# EasyEDA Pro project MiaoUI_TestBoard.epro

# Schematic Schematic1
Board Name: Board1; Create Date: 2024-10-20
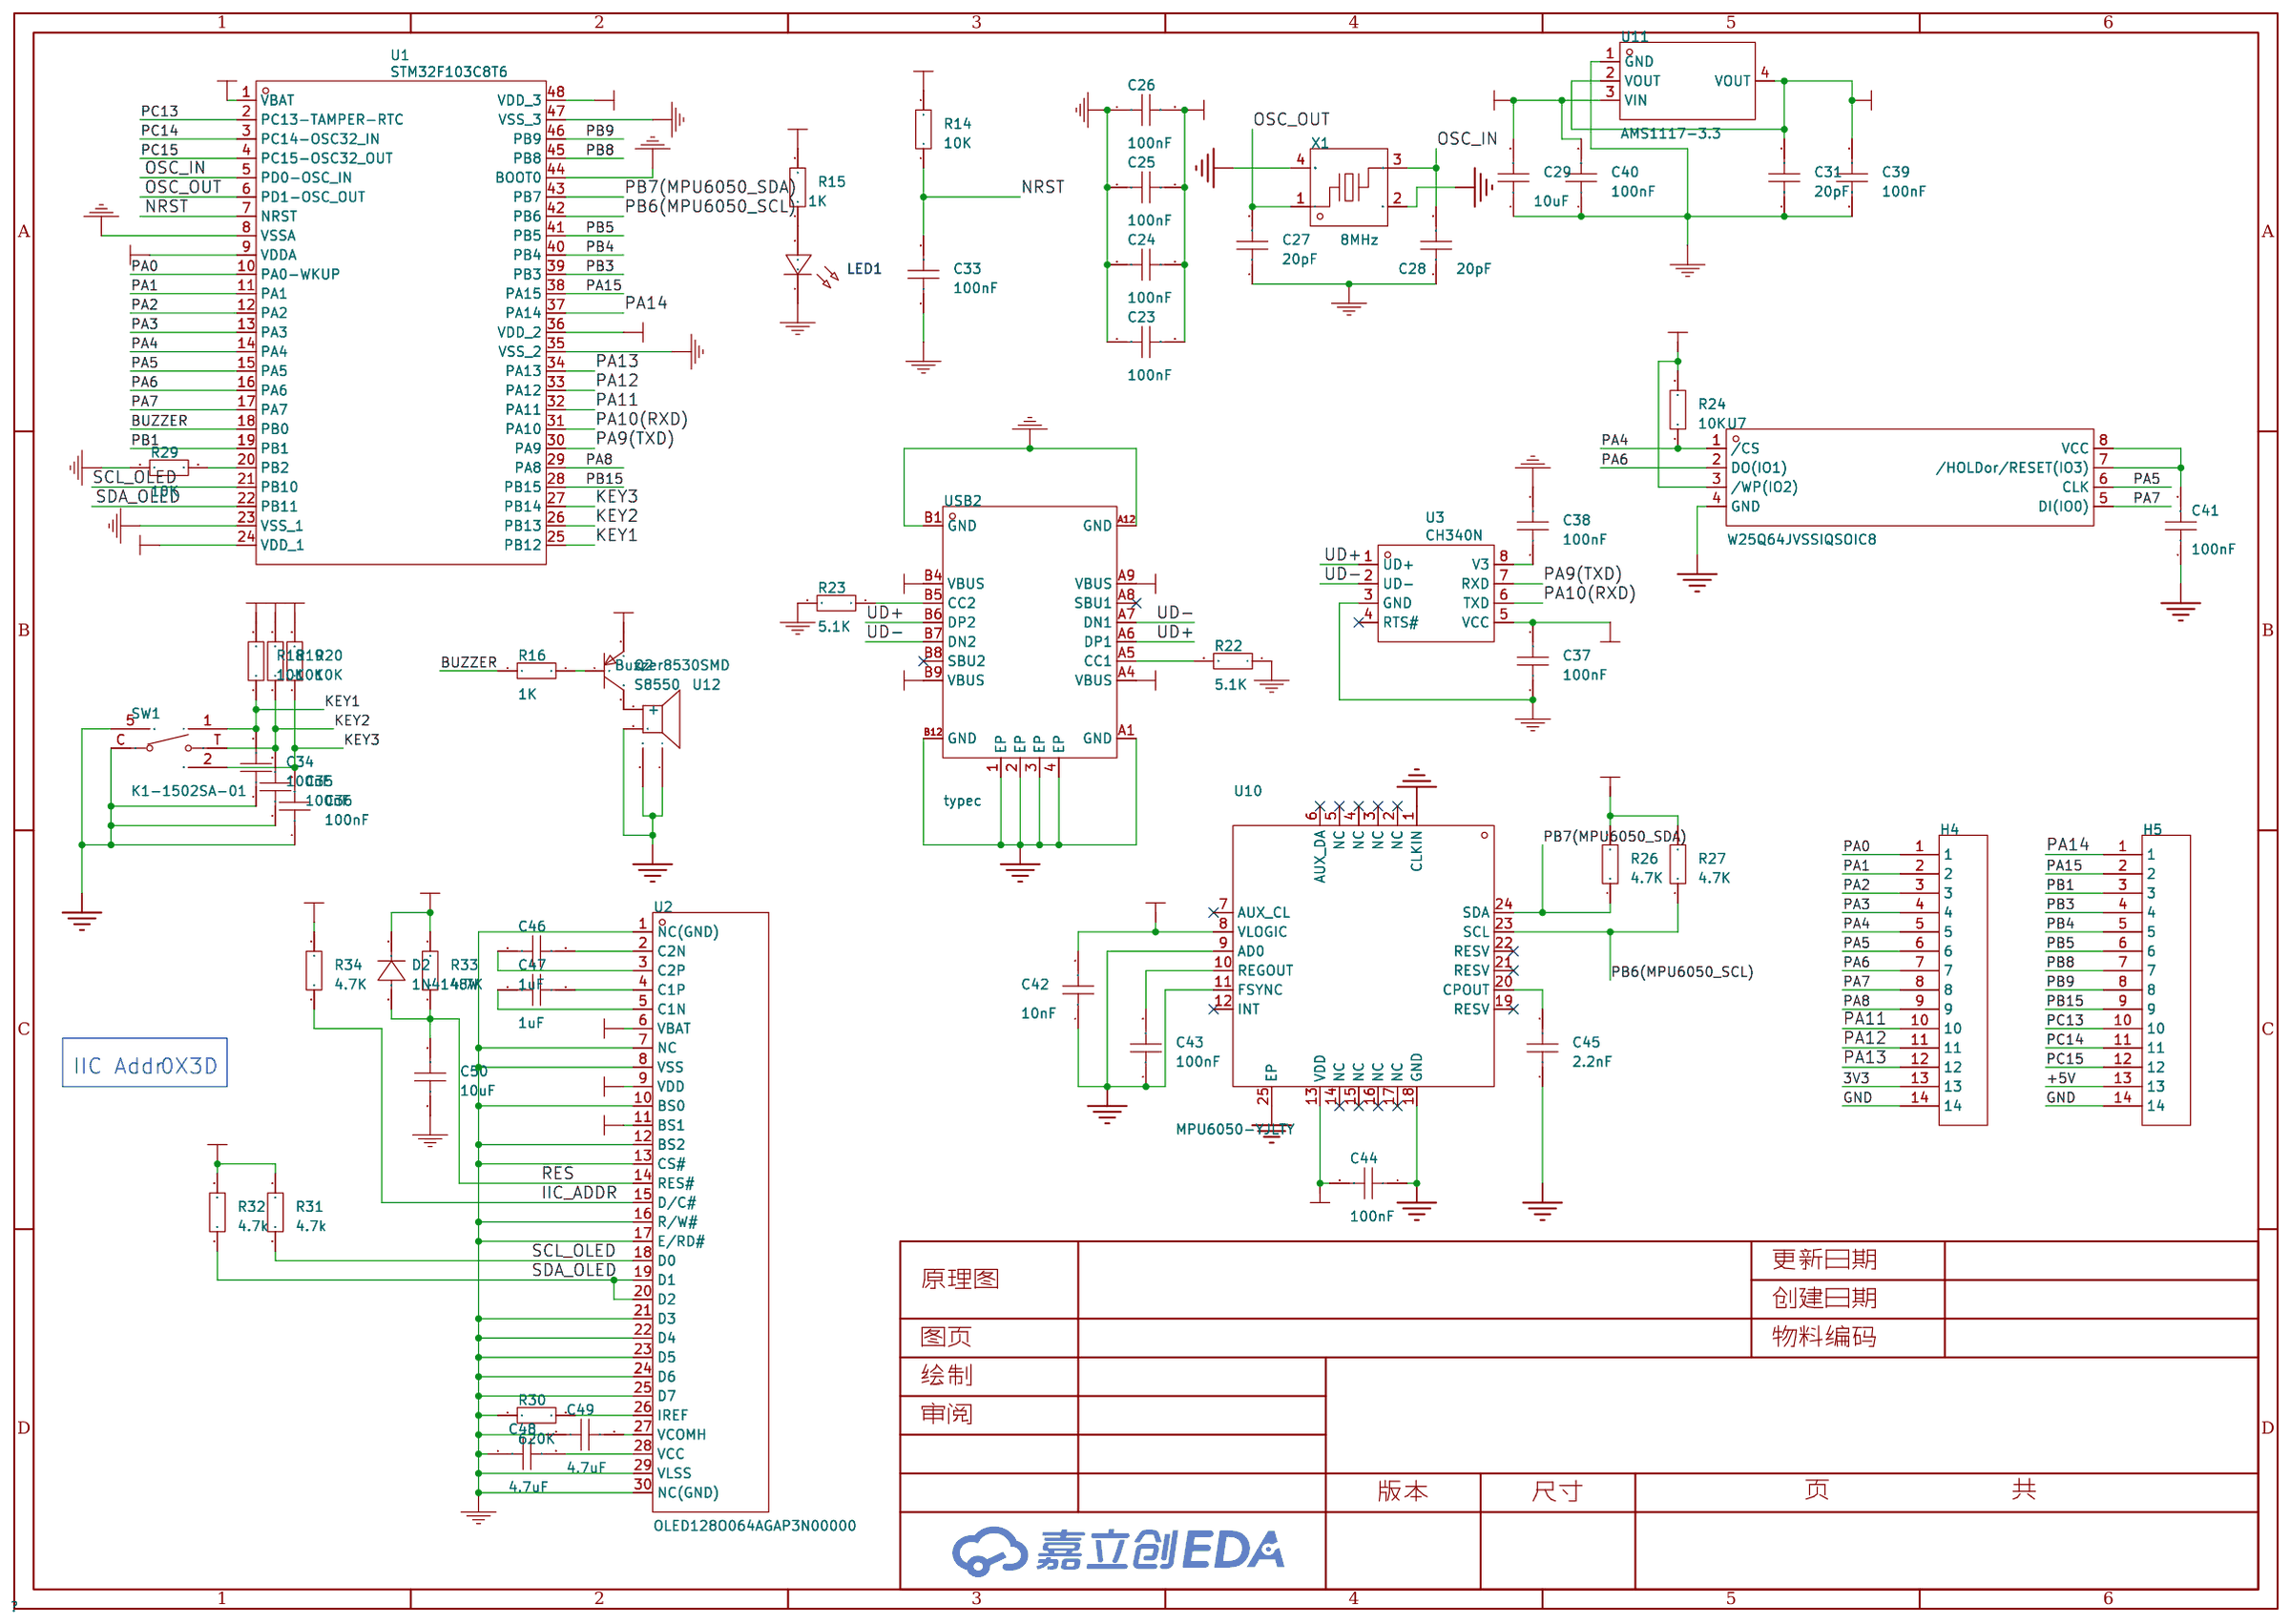
[diagram p0: schematic sheet]

## Parts
C23  100nF  [C0603]
C24  100nF  [C0603]
C25  100nF  [C0603]
C26  100nF  [C0603]
C27  20pF  [C0603]
C28  20pF  [C0603]
C29  10uF  [C0603]
C31  20pF  [C0603]
C33  100nF  [C0603]
C34  100nF  [C0603]
C35  100nF  [C0603]
C36  100nF  [C0603]
C37  100nF  [C0603]
C38  100nF  [C0603]
C39  100nF  [C0603]
C40  100nF  [C0603]
C41  100nF  [C0603]
C42  10nF  [C0603]
C43  100nF  [C0603]
C44  100nF  [C0603]
C45  2.2nF  [C0603]
C46  1uF  [C0603]
C47  1uF  [C0603]
C48  4.7uF  [C0603]
C49  4.7uF  [C0603]
C50  10uF  [C0603]
D2  1N4148W  [SOD-123_L2.7-W1.6-LS3.7-RD-1]
H4  -  [HDR-TH_14P-P2.54-V-F-1]
H5  -  [HDR-TH_14P-P2.54-V-F-1]
LED1  -  [LED_0603]
Q2  S8550  [SOT-23-3_L2.9-W1.3-P1.90-LS2.4-BR]
R14  10K  [R0603]
R15  1K  [R0603]
R16  1K  [R0603]
R18  10K  [R0603]
R19  10K  [R0603]
R20  10K  [R0603]
R22  5.1K  [R0603]
R23  5.1K  [R0603]
R24  10K  [R0603]
R26  4.7K  [R0603]
R27  4.7K  [R0603]
R29  10K  [R0603]
R30  620K  [R0603]
R31  4.7k  [R0603]
R32  4.7k  [R0603]
R33  4.7K  [R0603]
R34  4.7K  [R0603]
SW1  K1-1502SA-01  [KEY-SMD_K1-1502SA-01]
U1  STM32F103C8T6  [LQFP-48_L7.0-W7.0-P0.50-LS9.0-BL]
U2  OLED128O064AGAP3N00000  [tft-smd_oled128o064agap3n00000]
U3  CH340N  [SOP-8_L5.0-W4.0-P1.27-LS6.0-BL]
U7  W25Q64JVSSIQSOIC8  [SOIC-8_L5.3-W5.3-P1.27-LS7.9-BL]
U10  MPU6050-YJLTY  [QFN-24_L4.0-W4.0-P0.50-BL-EP2.7]
U11  AMS1117-3.3  [SOT-223-3_L6.5-W3.4-P2.30-LS7.0-BR]
U12  Buzzer8530SMD  [BUZ-SMD_4P-L8.5-W8.5-P8.50-TL]
USB2  typec  [usb-c-smd_kh-type-c-16p]
X1  8MHz  [OSC-SMD_4P-L3.2-W2.5-BL]

## Library data of the parts
C23-C29 C31 C33-C50 = CAP_0603: Supplier Footprint: 0603
D2 = 1N4148W: 二极管配置:-;正向压降(Vf):1.25V@100mA;直流反向耐压(Vr):-;平均整流电流(Io):150mA;功率:500mW;反向恢复时间(trr):4ns;; LCSC Part Name: 电流:150mA; Supplier Part: C2892570; Manufacturer: YONGYUTAI(永裕泰); Supplier Footprint: SOD-123; JLCPCB Part Class: 扩展库; Datasheet: https://atta.szlcsc.com/upload/public/pdf/source/20210906/424708ED2E76C29D36F058AA2585E916.pdf; Supplier: LCSC; Forward Voltage (Vf@If): 1.25V@100mA; Average Rectified Current (Io): 150mA; Power Dissipation: 500mW; Reverse Leakage Current: 5uA@75V; Reverse Recovery Time (trr): 4ns
H4 H5 = HDR-F-2.54_1x14P: Supplier Part: C52711; Supplier Footprint: 插件
LED1 = LED_0603-B: Supplier Footprint: 0603
Q2 = S8550: LCSC Part Name: PNP -25V -500mA 120-400 SOT-23; Supplier Part: C2931720; Manufacturer: Doeshare(德芯); Supplier Footprint: SOT-23; JLCPCB Part Class: 扩展库; Datasheet: https://atta.szlcsc.com/upload/public/pdf/source/20220104/15A23F6542E365B9E2BA018BE45092B6.pdf; Supplier: LCSC
R14-R16 R18-R20 R22-R24 R26 R27 R29-R34 = Res_0603: Supplier Footprint: 0603
SW1 = K1-1502SA-01: Supplier Part: C145915; Manufacturer: 韩国韩荣; Supplier Footprint: SMD,12.4x11.8mm; Datasheet: https://atta.szlcsc.com/upload/public/pdf/source/20210810/68556D289DEA90EEE2C9C67C3CF0D02D.pdf; Supplier: LCSC
U1 = STM32F103C8T6: Supplier: LCSC; Manufacturer: ST(意法半导体); Supplier Part: C8734; JLCPCB Part Class: Extended Part; link: https://so.szlcsc.com/global.html?k=C8734&amp;ref=editor
U2 = OLED128O064AGAP3N00000: 接口类型:-;尺寸(inch):-;像素分辨率:-;; Supplier Part: C17246337; Manufacturer: VISHAY(威世); Supplier: LCSC
U3 = CH340N: Supplier: LCSC; Supplier Part: C506813; Manufacturer: WCH(南京沁恒); JLCPCB Part Class: Extended Part; link: https://so.szlcsc.com/global.html?k=C506813&amp;ref=editor
U7 = W25Q64JVSSIQSOIC8: Supplier Part: C9900009206; Supplier Footprint: SOIC-8-208mil; JLCPCB Part Class: 扩展库; Supplier: LCSC
U10 = MPU6050-YJLTY: Supplier Part: C2912107; Supplier Footprint: QFN-24-EP(4x4); JLCPCB Part Class: 扩展库; Supplier: LCSC
U11 = AMS1117-3.3_C6186: 输出类型:固定;最大输入电压:-;输出电压:3.3V;最大输出电流:1A;电源纹波抑制比(PSRR):72dB@(120Hz);输出极性:正极;; LCSC Part Name: 输出3.3V 1A; Supplier Part: C6186; Manufacturer: AMS; Supplier Footprint: SOT-223; JLCPCB Part Class: 基础库; Datasheet: https://atta.szlcsc.com/upload/public/pdf/source/20180727/C6186_7A095716F0823C02F1997A905E26C086.pdf; Supplier: LCSC; Output Type: 固定; Output Voltage: 3.3V; MAX Output Current: 1A; Power Supply Rejection Ratio (PSRR): 72dB@(120Hz); Dropout Voltage: 1.3V@(800mA); Output Polarity: 正极; Number of Outputs: 1
U12 = Buzzer8530SMD: Supplier Part: C9900004191; Supplier Footprint: BuzzerMLT8530; JLCPCB Part Class: 扩展库; Supplier: LCSC
USB2 = typec: Supplier Part: C9900016956; Supplier Footprint: typec 12p; JLCPCB Part Class: 扩展库; Supplier: LCSC
X1 = X32258MOB4SI: 晶振类型:贴片晶振;频率:8MHz;常温频差:±10ppm;外接负载电容:12pF;频率稳定度(全温):±20ppm;; LCSC Part Name: 8MHz ±10ppm 12pF; Supplier Part: C2682775; Manufacturer: YXC(扬兴晶振); Supplier Footprint: SMD3225-4P; JLCPCB Part Class: 扩展库; Datasheet: https://atta.szlcsc.com/upload/public/pdf/source/20240329/19D5F850207469550BEB00D7DFEDBC7A.pdf; Supplier: LCSC; Crystal Type: 贴片晶振; Normal temperature Frequency Tolerance: ±10ppm; External load capacitor: 12pF; Frequency Stability(Full temperature range): ±20ppm; Equivalent Series Resistance (ESR): 150Ω; Operating Temperature: -40℃~+85℃

## Nets
3V3: C23.2 C24.2 C25.2 C26.2 C31.2 C39.2 C42.2 C44.2 D2.1(K) H4.13 Q2.2(E) R14.2 R15.2 R18.2 R19.2 R20.2 R24.2 R26.2 R27.2 R31.1 R32.2 R33.2 R34.2 U1.1(VBAT) U1.9(VDDA) U1.24(VDD_1) U1.36(VDD_2) U1.48(VDD_3) U2.6(VBAT) U2.9(VDD) U2.11(BS1) U7.3(/WP(IO2)) U10.8(VLOGIC) U10.13(VDD) U11.2(VOUT) U11.4(VOUT)
+5V: C29.2 C37.2 C40.2 H5.13 U3.5(VCC) U11.3(VIN) USB2.A4(VBUS) USB2.A9(VBUS) USB2.B4(VBUS) USB2.B9(VBUS)
GND: C23.1 C24.1 C25.1 C26.1 C27.1 C28.1 C29.1 C31.1 C33.1 C34.1 C35.1 C36.1 C37.1 C38.2 C39.1 C40.1 C41.1 C42.1 C43.1 C44.1 C45.1 C48.1 C49.1 C50.1 H4.14 H5.14 LED1.1(C) R22.1 R23.2 R29.1 R30.1 SW1.5 SW1.C U1.8(VSSA) U1.23(VSS_1) U1.35(VSS_2) U1.44(BOOT0) U1.47(VSS_3) U2.1(NC(GND)) U2.7(NC) U2.8(VSS) U2.10(BS0) U2.12(BS2) U2.13(CS#) U2.16(R/W#) U2.17(E/RD#) U2.21(D3) U2.22(D4) U2.23(D5) U2.24(D6) U2.25(D7) U2.29(VLSS) U2.30(NC(GND)) U3.3(GND) U7.4(GND) U10.1(CLKIN) U10.9(AD0) U10.11(FSYNC) U10.18(GND) U10.25(EP) U11.1(GND) U12.2 U12.3 U12.4 USB2.1(EP) USB2.2(EP) USB2.3(EP) USB2.4(EP) USB2.A1(GND) USB2.A12(GND) USB2.B1(GND) USB2.B12(GND) X1.2(GND) X1.4(GND)
BUZZER: R16.1 U1.18(PB0)
IIC_ADDR: R34.1 U2.15(D/C#)
KEY1: C34.2 R18.1 SW1.1 U1.25(PB12)
KEY2: C35.2 R19.1 SW1.T U1.26(PB13)
KEY3: C36.2 R20.1 SW1.2 U1.27(PB14)
NRST: C33.2 R14.1 U1.7(NRST)
OSC_IN: C28.2 U1.5(PD0-OSC_IN) X1.3
OSC_OUT: C27.2 U1.6(PD1-OSC_OUT) X1.1
PA0: H4.1 U1.10(PA0-WKUP)
PA1: H4.2 U1.11(PA1)
PA2: H4.3 U1.12(PA2)
PA3: H4.4 U1.13(PA3)
PA4: H4.5 R24.1 U1.14(PA4) U7.1(/CS)
PA5: H4.6 U1.15(PA5) U7.6(CLK)
PA6: H4.7 U1.16(PA6) U7.2(DO(IO1))
PA7: H4.8 U1.17(PA7) U7.5(DI(IO0))
PA8: H4.9 U1.29(PA8)
PA9(TXD): U1.30(PA9) U3.7(RXD)
PA10(RXD): U1.31(PA10) U3.6(TXD)
PA11: H4.10 U1.32(PA11)
PA12: H4.11 U1.33(PA12)
PA13: H4.12 U1.34(PA13)
PA14: H5.1 U1.37(PA14)
PA15: H5.2 U1.38(PA15)
PB1: H5.3 U1.19(PB1)
PB3: H5.4 U1.39(PB3)
PB4: H5.5 U1.40(PB4)
PB5: H5.6 U1.41(PB5)
PB6(MPU6050_SCL): R27.1 U1.42(PB6) U10.23(SCL)
PB7(MPU6050_SDA): R26.1 U1.43(PB7) U10.24(SDA)
PB8: H5.7 U1.45(PB8)
PB9: H5.8 U1.46(PB9)
PB15: H5.9 U1.28(PB15)
PC13: H5.10 U1.2(PC13-TAMPER-RTC)
PC14: H5.11 U1.3(PC14-OSC32_IN)
PC15: H5.12 U1.4(PC15-OSC32_OUT)
RES: C50.2 D2.2(A) R33.1 U2.14(RES#)
SCL_OLED: R31.2 U1.21(PB10) U2.18(D0)
SDA_OLED: R32.1 U1.22(PB11) U2.19(D1) U2.20(D2)
UD+: U3.1(UD+) USB2.A6(DP1) USB2.B6(DP2)
UD-: U3.2(UD-) USB2.A7(DN1) USB2.B7(DN2)
$1N2097: LED1.2(A) R15.1
$1N2713: R30.2 U2.26(IREF)
$1N2714: C49.2 U2.27(VCOMH)
$1N2715: C48.2 U2.28(VCC)
$1N2716: C46.1 U2.3(C2P)
$1N2717: C46.2 U2.2(C2N)
$1N2718: C47.1 U2.5(C1N)
$1N2719: C47.2 U2.4(C1P)
$1N4956: Q2.1(B) R16.2
$1N5026: Q2.3(C) U12.1(+)
$1N6067: C38.1 U3.8(V3)
$1N6367: C41.2 U7.7(/HOLDor/RESET(IO3)) U7.8(VCC)
$1N6697: C43.2 U10.10(REGOUT)
$1N6965: C45.2 U10.20(CPOUT)
$1N8605: R29.2 U1.20(PB2)
$1N9414: R22.2 USB2.A5(CC1)
$1N9519: R23.1 USB2.B5(CC2)

Not connected (* = marked no-connect by the designer): U3 4(RTS#)*; U10 2(NC)* 3(NC)* 4(NC)* 5(NC)* 6(AUX_DA)* 7(AUX_CL)* 12(INT)* 14(NC)* 15(NC)* 16(NC)* 17(NC)* 19(RESV)* 21(RESV)* 22(RESV)*; USB2 A8(SBU1)* B8(SBU2)*

## Notes on the sheet
- IIC Addr
- 0X3D

# Board PCB1
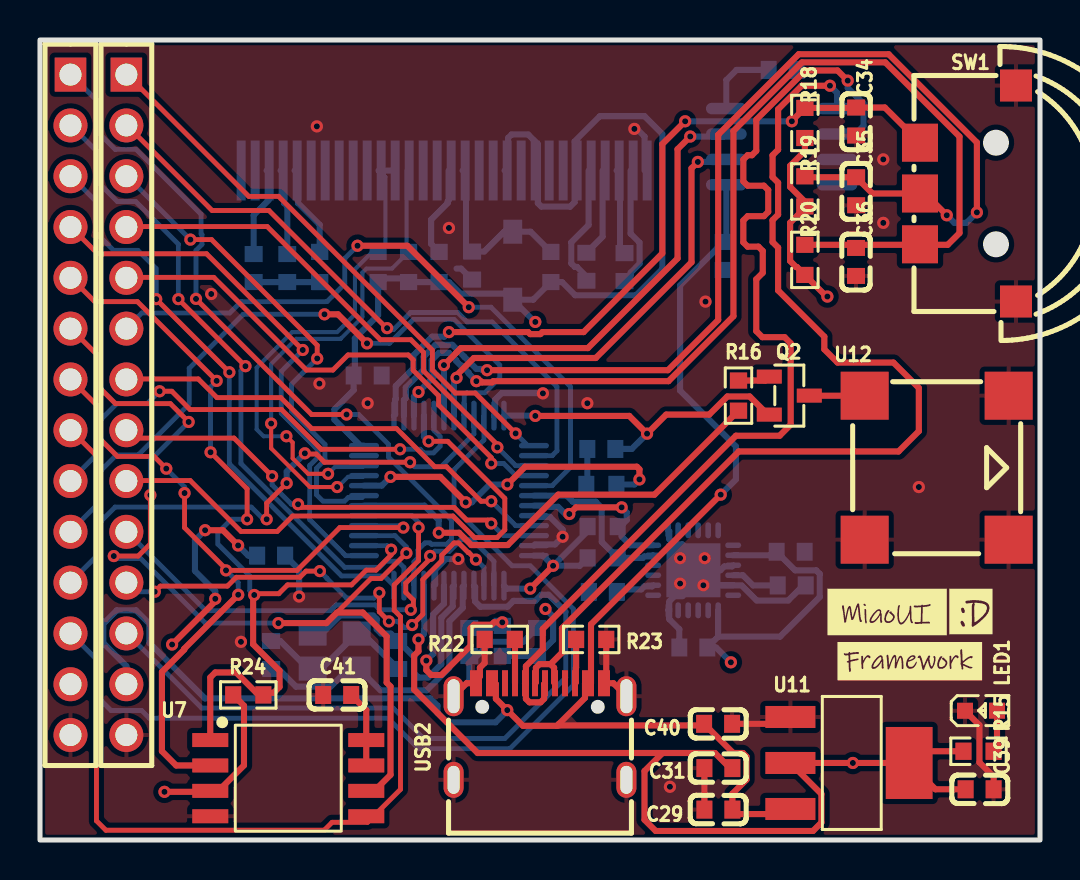
[diagram p1: board, top side]
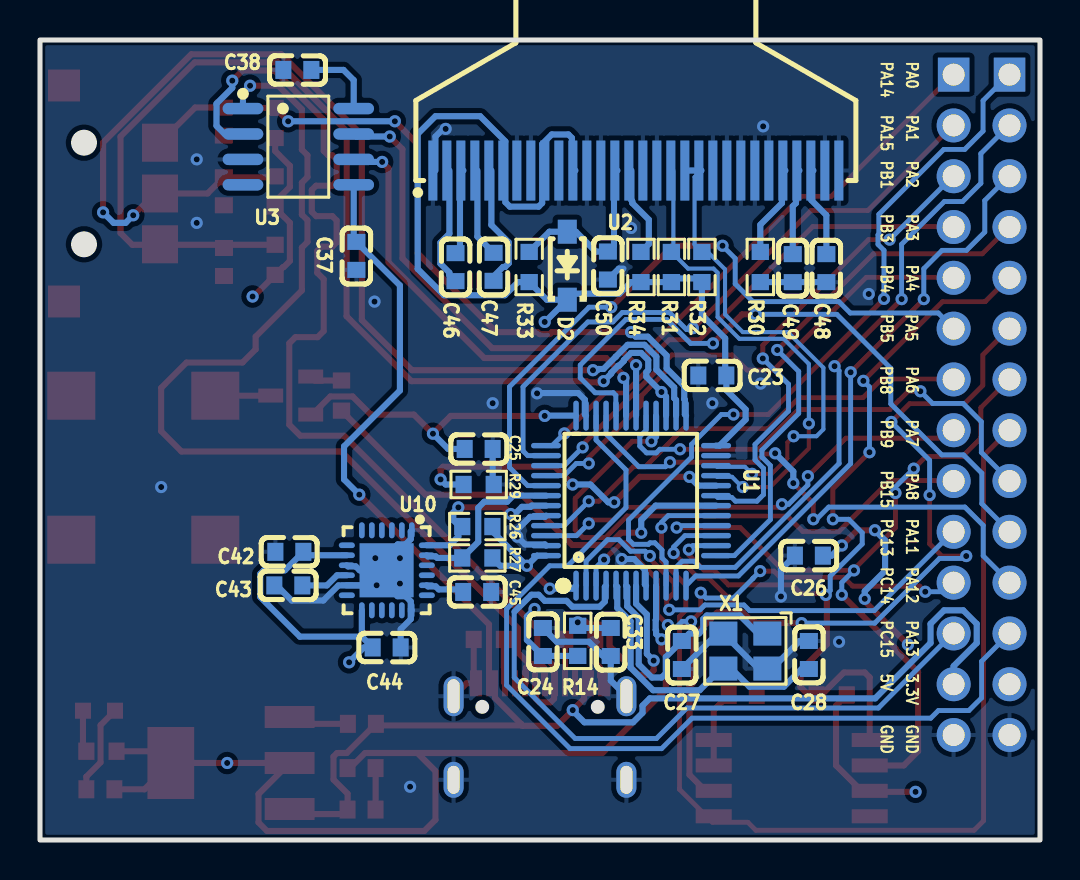
[diagram p2: board, bottom side, seen from below]

Outline 50 x 40 mm; copper layers: Top Layer, Inner1, Inner2, Bottom Layer. Coordinates in mm from the lower left corner of the outline.
Outline path: rectangle 0,40 50,0
Stack: Top Layer 0.035mm 外层铜厚1oz / Dielectric1 0.2104mm 7628 RC49% 8.6mil / Inner1 0.0152mm 内层铜厚 / Dielectric2 1.065mm 1.1mm H/HOZ Copper / Inner2 0.0152mm 内层铜厚 / Dielectric3 0.2104mm 7628 RC49% 8.6mil / Bottom Layer 0.035mm 外层铜厚1oz

## Design rules (mm)
template: 自定义配置
spacing copperThickness1oz (default): track to track 0.102, other pairs 0.152 to 0.3
spacing copperThickness2oz: track to track 0.203, other pairs 0.152 to 0.3
track width copperThickness1oz (default): min 0.127, default 0.305, max 2.54
track width copperThickness2oz: min 0.203, default 0.254, max 2.54
differential pair differentialPair (default): width min 0.127, default 0.254, max 2.54; gap min 0.152, default 0.152
via viaSize (default): diameter min 0.5, default 0.61, max 10; hole min 0.3, default 0.305, max 6.299

## Placement (name value [footprint] x y rotation side)
C23  100nF  [C0603]  16.38 23.23 180 bottom
C24  100nF  [C0603]  24.86 9.9 270 bottom
C25  100nF  [C0603]  28.07 19.55 0 bottom
C26  100nF  [C0603]  11.56 14.22 180 bottom
C27  20pF  [C0603]  17.91 9.25 90 bottom
C28  20pF  [C0603]  11.56 9.25 270 bottom
C29  10uF  [C0603]  33.92 1.52 0 top
C31  20pF  [C0603]  33.92 3.59 0 top
C33  100nF  [C0603]  21.46 9.9 90 bottom
C34  100nF  [C0603]  40.81 35.92 90 top
C35  100nF  [C0603]  40.81 32.44 90 top
C36  100nF  [C0603]  40.8 28.9 90 top
C37  100nF  [C0603]  34.18 29.2 90 bottom
C38  100nF  [C0603]  37.13 38.5 0 bottom
C39  100nF  [C0603]  46.98 2.53 180 top
C40  100nF  [C0603]  33.9 5.81 180 top
C41  100nF  [C0603]  14.86 7.25 0 top
C42  10nF  [C0603]  37.53 14.41 180 bottom
C43  100nF  [C0603]  37.58 12.73 180 bottom
C44  100nF  [C0603]  32.67 9.63 0 bottom
C45  2.2nF  [C0603]  28.14 12.4 0 bottom
C46  1uF  [C0603]  29.22 28.64 270 bottom
C47  1uF  [C0603]  27.32 28.66 90 bottom
C48  4.7uF  [C0603]  10.68 28.59 90 bottom
C49  4.7uF  [C0603]  12.36 28.59 90 bottom
C50  10uF  [C0603]  21.6 28.72 90 bottom
D2  1N4148W  [SOD-123_L2.7-W1.6-LS3.7-RD-1]  23.64 28.71 90 bottom
H4  -  [HDR-TH_14P-P2.54-V-F-1]  1.52 21.76 270 top
H5  -  [HDR-TH_14P-P2.54-V-F-1]  4.32 21.76 270 top
LED1  -  [LED_0603]  47.1 6.47 0 top
Q2  S8550  [SOT-23-3_L2.9-W1.3-P1.90-LS2.4-BR]  37.47 22.22 180 top
R14  10K  [R0603]  23.11 9.96 270 bottom
R15  1K  [R0603]  46.93 4.44 180 top
R16  1K  [R0603]  34.93 22.22 90 top
R18  10K  [R0603]  38.24 35.85 270 top
R19  10K  [R0603]  38.24 32.43 270 top
R20  10K  [R0603]  38.24 29.01 270 top
R22  5.1K  [R0603]  22.99 10.03 0 top
R23  5.1K  [R0603]  27.56 10.03 0 top
R24  10K  [R0603]  10.41 7.25 180 top
R26  4.7K  [R0603]  28.13 15.67 180 bottom
R27  4.7K  [R0603]  28.13 14.1 180 bottom
R29  10K  [R0603]  28.07 17.78 0 bottom
R30  620K  [R0603]  13.98 28.65 90 bottom
R31  4.7k  [R0603]  18.43 28.65 90 bottom
R32  4.7k  [R0603]  16.91 28.65 270 bottom
R33  4.7K  [R0603]  25.54 28.65 270 bottom
R34  4.7K  [R0603]  19.95 28.65 270 bottom
SW1  K1-1502SA-01  [KEY-SMD_K1-1502SA-01]  46.4 32.33 270 top
U1  STM32F103C8T6  [LQFP-48_L7.0-W7.0-P0.50-LS9.0-BL]  20.45 16.97 180 bottom
U2  OLED128O064AGAP3N00000  [tft-smd_oled128o064agap3n00000]  20.21 33.47 180 bottom
U3  CH340N  [SOP-8_L5.0-W4.0-P1.27-LS6.0-BL]  37.08 34.67 270 bottom
U7  W25Q64JVSSIQSOIC8  [SOIC-8_L5.3-W5.3-P1.27-LS7.9-BL]  12.41 3.09 270 top
U10  MPU6050-YJLTY  [QFN-24_L4.0-W4.0-P0.50-BL-EP2.7]  32.66 13.49 0 bottom
U11  AMS1117-3.3  [SOT-223-3_L6.5-W3.4-P2.30-LS7.0-BR]  40.49 3.85 180 top
U12  Buzzer8530SMD  [BUZ-SMD_4P-L8.5-W8.5-P8.50-TL]  44.83 18.61 0 top
USB2  typec  [usb-c-smd_kh-type-c-16p]  25 5.42 0 top
X1  8MHz  [OSC-SMD_4P-L3.2-W2.5-BL]  14.73 9.45 0 bottom

## Footprints (pads in the part's own frame, mm; a bottom-side part is the same pattern mirrored in y, then rotated)
BUZ-SMD_4P-L8.5-W8.5-P8.50-TL
  rect 2.4x2.4 smd: 1(-3.6,3.6) 2(-3.6,-3.6) 3(3.599,-3.599) 4(3.6,3.6)
C0603
  rect 0.8x0.9 smd: 1(-0.7,0) 2(0.7,0)
HDR-TH_14P-P2.54-V-F-1
  rect 1.7x1.575 hole 1.1: 1(-16.51,0)
  round 1.7 hole 1.1: 2(-13.97,0) 3(-11.43,0) 4(-8.89,0) 5(-6.35,0) 6(-3.81,0) 7(-1.27,0) 8(1.27,0) 9(3.81,0) 10(6.35,0) 11(8.89,0) 12(11.43,0) 13(13.97,0) 14(16.51,0)
KEY-SMD_K1-1502SA-01
  rect 1.9x1.8 smd: 1(-2.54,-2.4) 2(2.54,-2.4) T(0,-2.4)
  rect 1.6x1.6 smd: 5(-5.4,2.4) C(5.4,2.4)
LED_0603
  rect 0.8x0.8 smd: 1(-0.851,-0.01) 2(0.75,-0.005)
LQFP-48_L7.0-W7.0-P0.50-LS9.0-BL
  oval 0.27x1.5 smd: 1(-2.75,-4.25) 2(-2.25,-4.25) 3(-1.75,-4.25) 4(-1.25,-4.25) 5(-0.75,-4.25) 6(-0.25,-4.25) 7(0.25,-4.25) 8(0.75,-4.25) 9(1.25,-4.25) 10(1.75,-4.25) 11(2.25,-4.25) 12(2.75,-4.25) 25(2.75,4.25) 26(2.25,4.25) 27(1.75,4.25) 28(1.25,4.25) 29(0.75,4.25) 30(0.25,4.25) 31(-0.25,4.25) 32(-0.75,4.25) 33(-1.25,4.25) 34(-1.75,4.25) 35(-2.25,4.25) 36(-2.75,4.25)
  oval 1.5x0.27 smd: 13(4.25,-2.75) 14(4.25,-2.25) 15(4.25,-1.75) 16(4.25,-1.25) 17(4.25,-0.75) 18(4.25,-0.25) 19(4.25,0.25) 20(4.25,0.75) 21(4.25,1.25) 22(4.25,1.75) 23(4.25,2.25) 24(4.25,2.75) 37(-4.25,2.75) 38(-4.25,2.25) 39(-4.25,1.75) 40(-4.25,1.25) 41(-4.25,0.75) 42(-4.25,0.25) 43(-4.25,-0.25) 44(-4.25,-0.75) 45(-4.25,-1.25) 46(-4.25,-1.75) 47(-4.25,-2.25) 48(-4.25,-2.75)
OSC-SMD_4P-L3.2-W2.5-BL
  rect 1.4x1.2 smd: 1(-1.1,-0.875) 2(1.1,-0.875) 3(1.1,0.875) 4(-1.1,0.875)
QFN-24_L4.0-W4.0-P0.50-BL-EP2.7
  oval 0.28x0.8 smd: 1(-1.25,-2) 2(-0.75,-2) 3(-0.25,-2) 4(0.25,-2) 5(0.75,-2) 6(1.25,-2) 13(1.25,2) 14(0.75,2) 15(0.25,2) 16(-0.25,2) 17(-0.75,2) 18(-1.242,2)
  oval 0.8x0.28 smd: 7(2,-1.25) 8(2,-0.75) 9(2,-0.25) 10(2,0.25) 11(2,0.75) 12(2,1.25) 19(-2,1.25) 20(-2,0.75) 21(-2,0.25) 22(-2,-0.25) 23(-2,-0.75) 24(-2,-1.25)
  rect 2.7x2.7 smd: 25(0.013,0)
R0603
  rect 0.806x0.864 smd: 1(-0.753,0) 2(0.753,0)
SOD-123_L2.7-W1.6-LS3.7-RD-1
  rect 1.2x0.95 smd: 1(-1.7,0) 2(1.7,0)
SOIC-8_L5.3-W5.3-P1.27-LS7.9-BL
  rect 0.7x1.8 smd: 1(-1.905,-3.9) 2(-0.635,-3.9) 3(0.635,-3.9) 4(1.905,-3.9) 5(1.905,3.9) 6(0.635,3.9) 7(-0.635,3.9) 8(-1.905,3.9)
SOP-8_L5.0-W4.0-P1.27-LS6.0-BL
  oval 0.574x2.035 smd: 1(-1.905,-2.768) 2(-0.635,-2.768) 3(0.635,-2.768) 4(1.905,-2.768) 5(1.905,2.768) 6(0.635,2.768) 7(-0.635,2.768) 8(-1.905,2.768)
SOT-23-3_L2.9-W1.3-P1.90-LS2.4-BR
  rect 1.25x0.7 smd: 1(1,-0.95) 2(1,0.95) 3(-1,0)
SOT-223-3_L6.5-W3.4-P2.30-LS7.0-BR
  rect 2.5x1.1 smd: 1(2.97,-2.3) 2(2.97,0) 3(2.97,2.3)
  rect 2.34x3.6 smd: 4(-2.97,0)
tft-smd_oled128o064agap3n00000
  rect 0.45x3 smd: 1(-10.15,0) 2(-9.45,0) 3(-8.75,0) 4(-8.05,0) 5(-7.35,0) 6(-6.65,0) 7(-5.95,0) 8(-5.25,0) 9(-4.55,0) 10(-3.85,0) 11(-3.15,0) 12(-2.45,0) 13(-1.75,0) 14(-1.05,0) 15(-0.35,0) 16(0.35,0) 17(1.05,0) 18(1.75,0) 19(2.45,0) 20(3.15,0) 21(3.85,0) 22(4.55,0) 23(5.25,0) 24(5.95,0) 25(6.65,0) 26(7.35,0) 27(8.05,0) 28(8.75,0) 29(9.45,0) 30(10.15,0)
usb-c-smd_kh-type-c-16p
  oval 1x2 hole 0.6x1.7: 1(-4.32,1.765) 2(4.32,1.765)
  oval 1x1.8 hole 0.6x1.4: 3(-4.32,-2.415) 4(4.32,-2.415)
  rect 0.3x1.3 smd: A1(-3.35,2.415) A4(-2.55,2.415) A5(-1.25,2.415) A6(-0.25,2.415) A7(0.25,2.415) A8(1.25,2.415) A9(2.55,2.415) A12(3.35,2.415) B1(3.05,2.415) B4(2.25,2.415) B5(1.75,2.415) B6(0.75,2.415) B7(-0.75,2.415) B8(-1.75,2.415) B9(-2.25,2.415) B12(-3.05,2.415)

## Nets
As in the schematic.

Pads without a net: U3 4; U10 2 3 4 5 6 7 12 14 15 16 17 19 21 22; USB2 A8 B8

## Via types
v1: diameter 0.61, hole 0.305, Top Layer to Bottom Layer, 117 vias

## Routing (per net, layer and track width the routed paths; a pad name or vN(x,y) marks a point on that pad's centre or on a via; arc(x,y) is an arc through that point)
3V3: length 176.1
  Top Layer w0.305: v1(24.76,21.2) 29.46,21.2 v1(30.35,20.31) 31.31,21.27 33.46,21.27 34.37,22.17 35.48,22.17 36.39,21.27 Q2.2 ; R18.2 38.24,34.45 37.51,33.71 37.51,32.65 38.24,31.92 R19.2 38.24,31.6 37.51,30.86 37.51,28.95 37.81,28.65 37.85,28.65 R20.2 39.32,27.17 v1(39.37,27.17) ; 31.13,4.35 33.75,4.35 34.5,3.59 C31.2 ; 31.13,4.35 21.88,4.35 18.71,7.52 18.71,9.22 18.92,9.44 v1(18.92,10.03) ; 31.13,4.35 30.23,3.45 30.23,1.01 30.78,0.45 38.65,0.45 39.07,0.88 39.07,2.3 U11.2 v1(40.64,3.85) U11.4 ; v1(24.51,12.57) v1(25.65,13.71) ; U11.4 44.04,4.44 R15.2 ; U11.4 44.78,2.53 C39.2 ; v1(6.22,2.41) 8.46,2.41 U7.3 8.92,2.46 10.2,3.73 10.2,6.72 R24.2 ; v1(8.76,12.06) 8.76,11.93 v1(6.6,9.77) ; v1(9.91,14.73) 9.14,15.49 v1(8.25,15.49)
  Bottom Layer w0.305: v1(25.65,13.71) 27.38,15.44 27.38,15.55 ; v1(25.65,13.71) 25.15,14.22 U1.48 ; v1(25.65,13.71) 26.99,13.71 R27.2 ; 33.91,10.17 C44.2 33.8,9.63 v1(34.54,8.89) ; 33.91,10.17 U10.13 ; 33.91,10.17 37,10.17 38.99,12.15 38.99,13.31 38.81,13.48 37.76,13.48 C42.2 36.66,14.24 U10.8 ; v1(24.76,21.2) 24.75,21.22 U1.36 ; C26.2 10.41,14.22 v1(9.91,14.73) ; 24.76,9.19 24.75,9.2 R14.2 ; D2.1 24.75,25.9 v1(24.76,25.9) ; D2.1 23.33,27.32 21.03,27.32 20.45,27.9 R34.2 R31.1 18.25,28.08 17.09,28.08 R32.2 16.91,26.25 15.74,25.08 15.74,23.28 C23.2 15.68,22.49 14.72,21.53 14.72,21.02 16.02,19.72 U1.24 ; D2.1 24.66,27.01 R33.2 26.1,27.9 26.76,27.24 29.8,27.24 31.12,28.55 31.12,35.3 30.23,36.19 27.99,36.19 26.73,34.93 26.73,31.89 26.51,31.67 25.07,31.67 24.89,31.85 24.89,34.79 24.41,35.28 23.58,35.28 23.4,35.1 23.4,33.64 23.23,33.47 ; U1.1 23.35,12.57 v1(24.51,12.57) ; v1(25.27,11.55) 25.65,11.17 25.65,10 C24.2 ; v1(30.35,20.31) 29.59,19.55 C25.2 ; v1(8.76,12.06) 8.76,12.44 7.75,13.46 7.75,14.98 v1(8.25,15.49) ; U1.9 19.2,11.02 19.22,11 19.22,10.5 19.2,10.48 19.2,10.3 v1(18.92,10.03)
+5V: length 80.9
  Top Layer w0.305: 25.95,5.81 25.85,5.71 24.15,5.71 v1(23.36,6.49) 22.79,7.06 22.79,7.79 USB2.B9 ; 25.95,5.81 25.95,5.73 33.12,5.73 C40.2 34.66,4.35 35.15,4.35 35.32,4.17 35.32,3.02 34.62,2.31 C29.2 34.84,1.3 37.52,1.3 ; 25.95,5.81 27.25,7.11 USB2.B4 USB2.A9 27.55,10.78 v1(34.04,17.27)
  Bottom Layer w0.305: H5.13 4.32,8.7 3.16,9.85 3.16,10.81 3.84,11.48 4.8,11.48 5.47,10.81 5.47,9.85 8.24,7.08 19.51,7.08 19.88,6.72 19.88,6.36 20.35,5.88 22.78,5.88 23.37,6.47 ; U3.5 34.32,30.04 C37.2 32,27.73 32,22.47 34.8,19.68 34.8,18.03 v1(34.04,17.27)
GND: length 70.2
  Top Layer w0.305: C40.1 37.18,5.81 U11.1 ; USB2.A1 21.33,7.84 USB2.1 ; USB2.A1 USB2.B12 ; USB2.A1 22,8.18 22,8.61 22.23,8.85 R22.1 ; LED1.1 46.97,5.74 46.97,3.88 47.68,3.17 C39.1 ; C31.1 C29.1 ; R23.2 28.31,7.88 USB2.A12 28.67,7.84 USB2.2
  Bottom Layer w0.305: C24.1 24.17,9.91 22.56,9.91 21.85,9.2 C33.1 21.46,7.97 USB2.1 ; U1.47 24.76,14.78 25.75,14.78 v1(26.13,15.16) 26.13,15.52 25.49,16.16 24.76,16.16 U1.44 ; C25.1 27.37,17.83 R29.1 ; v1(29.72,35.56) 29.84,35.56 30.23,35.17 30.23,33.47 ; U1.35 22.76,21.28 22.76,22.02 23.09,22.35 25.13,22.35 v1(25.15,22.33) ; 33.42,12.74 U10.25 ; 33.42,12.74 U10.11 ; 33.42,12.74 v1(33.17,12.74) 32.67,13.23 ; 33.42,12.74 33.43,12.73 35.08,12.73 35.83,11.97 37.41,11.97 38.17,12.73 C43.1 ; U10.25 34.02,13.49 34.21,13.68 34.6,13.68 U10.9 ; U10.25 32.67,14.22 32.11,14.78 31.72,14.78 31.46,15.04 31.46,15.43 U10.1 ; U10.25 32.67,13.23 ; 20.83,28.57 21.06,28.57 C50.1 ; 32.67,13.23 32.67,12.74 32.12,12.19 31.72,12.19 31.46,11.93 31.46,11.53 U10.18 31.46,11.44 31.46,11.04 31.97,10.54 C44.1 ; C48.1 C49.1 13.98,27.89 R30.1 ; v1(20.91,14.05) 20.29,14.05 19.76,13.52 19.76,12.78 U1.8 ; C28.1 12.01,9.95 13.4,8.57 X1.4 14.08,8.57 X1.2 16.14,10.32 C27.1 ; v1(12.95,12.17) 12.95,13.52 C26.1
  vias: v1(8.56,27.3) v1(10.05,9.91) v1(13.84,35.68) v1(13.97,22.82) v1(16.38,21.84) v1(20.45,30.6) v1(27.37,21.84) v1(31.5,2.66) v1(32,14.09) v1(32,12.82) v1(33.23,14.09) v1(33.27,26.92) v1(42.16,34.03) v1(42.16,30.86) v1(43.94,17.65)
BUZZER: length 22.7
  Top Layer w0.305: 34.93,21.47 30.72,17.27 25.91,17.27 23.39,14.75 21.57,14.75 20.95,15.36 v1(19.94,15.36)
  Bottom Layer w0.305: v1(19.94,15.36) 19.94,16 19.22,16.72 U1.18
IIC_ADDR: length 4.6
  Bottom Layer w0.305: R34.1 19.56,29.8 19.56,31.02 20.39,31.85 20.39,31.94 20.43,31.99 20.43,33.47
KEY1: length 37.9
  Top Layer w0.305: v1(20.45,25.39) 24.41,25.39 24.51,25.29 25.02,25.29 25.12,25.39 27.18,25.39 31.12,29.33 31.12,34.79 v1(32.26,35.94) ; v1(37.59,35.94) 37.59,35.95 R18.1 40.79,36.61 C34.2 42.24,36.62 44,34.86
  Bottom Layer w0.305: v1(20.45,25.39) 20.22,25.17 19.61,25.17 18.67,24.23 18.67,23.58 17.79,22.7 17.79,22.05 17.76,22.02 17.76,21.28 U1.25 ; v1(37.59,35.94) v1(32.26,35.94)
KEY2: length 58.9
  Top Layer w0.305: v1(45.34,31.24) 44.25,32.33 SW1.T 41.62,32.33 C35.2 38.29,33.14 R19.1 ; v1(46.84,31.38) 46.84,34.88 42.43,39.29 37.94,39.29 33.91,35.26 33.91,26 31.4,23.49 v1(22.35,23.49)
  Bottom Layer w0.305: v1(45.34,31.24) 45.72,30.86 46.32,30.86 v1(46.84,31.38) ; v1(22.35,23.49) 22.13,23.49 22.07,23.55 21.82,23.55 21.21,24.16 21.21,24.17 20.62,24.76 19.78,24.76 19.18,24.17 19.18,23.52 18.29,22.63 18.29,22.1 18.2,22 U1.26
KEY3: length 56.8
  Top Layer w0.305: v1(21.82,22.94) 22.04,22.94 22.1,22.88 22.6,22.88 22.67,22.94 31.42,22.94 34.67,26.19 34.67,35.45 38.1,38.88 42.26,38.88 45.97,35.17 45.97,30.35 45.39,29.76 R20.1
  Bottom Layer w0.305: v1(21.82,22.94) 21.44,23.32 21.44,23.36 21.08,23.72 21.04,23.72 20.81,23.95 20.81,24 20.45,24.35 19.94,24.35 19.59,24 19.59,23.49 19.69,23.39 19.69,23.16 v1(18.93,22.4) 18.7,22.17 U1.27
NRST: length 11.9
  Top Layer w0.305: v1(19.32,8.97) 19.32,8.49 19.56,8.25 20.07,8.25 21.53,9.71 21.53,10.59 21.7,10.77 22.58,10.77 22.7,10.88 v1(23.11,10.88)
  Bottom Layer w0.305: v1(19.32,8.97) 19.66,9.31 19.66,11.28 20.2,11.82 U1.7 ; C33.2 22.83,10.6 v1(23.11,10.88)
OSC_IN: length 15
  Bottom Layer w0.305: U1.5 21.14,12.66 21.14,11.61 20.47,10.94 20.47,8.62 19.34,7.49 17.02,7.49 15.94,8.57 X1.3 15.43,8.57 14.53,7.67 12.81,7.67 11.92,8.55 C28.2
OSC_OUT: length 13.3
  Bottom Layer w0.305: U1.6 20.64,12.66 20.64,11.68 20.06,11.11 20.06,8.78 19.4,8.12 18.92,8.12 18.71,8.34 18.71,9.15 C27.2 17.54,10.32 17.05,10.32 16.84,10.54 16.84,11.05 16.66,11.23 15.01,11.23 14.1,10.32 X1.1
PA0: length 37.2
  Top Layer w0.243: v1(15.33,21.27) 13.58,21.27 v1(7.8,27.06)
  Bottom Layer w0.243: v1(7.8,27.06) 7.8,29.48 8.1,29.78 8.1,30.26 8.05,30.3 8.05,31.29 4.81,34.53 3.76,34.53 2.85,35.44 2.85,36.97 1.52,38.29 ; U1.10 18.7,13.9 18.9,14.11 18.9,14.5 19.26,14.86 19.5,14.86 19.58,14.78 20.33,14.78 20.57,15.03 20.57,16 17.42,19.15 17.42,19.78 15.93,21.27 v1(15.33,21.27)
PA1: length 32.6
  Top Layer w0.243: v1(10.27,23.69) v1(6.92,27.04)
  Bottom Layer w0.243: v1(10.27,23.69) 10.05,23.47 10.05,18.83 15.24,13.63 16.98,13.63 17.28,13.94 17.89,13.94 18.2,13.63 U1.11 ; 1.52,35.75 2.96,34.32 2.96,32.83 3.87,31.92 4.79,31.92 6.92,29.79 v1(6.92,27.04)
PA2: length 29.2
  Top Layer w0.243: v1(9.47,23.39) v1(5.81,27.04)
  Bottom Layer w0.243: v1(5.81,27.04) 5.81,28.57 4.9,29.48 3.68,29.48 2.76,30.4 2.76,31.97 1.52,33.21 ; v1(9.47,23.39) 9.47,18.81 15.08,13.2 17.21,13.2 U1.12
PA3: length 27.5
  Top Layer w0.243: v1(13.14,24.5) 8.33,29.31 2.88,29.31 1.52,30.67
  Bottom Layer w0.243: U1.13 15.28,14.22 13.48,16.02 13.48,18.72 13.9,19.15 13.9,19.49 12.06,21.33 12.06,23.43 v1(13.14,24.5)
PA4: length 44.7
  Top Layer w0.243: v1(10.36,16.04) 10.36,17.56 v1(8.53,19.39) ; v1(10.71,12.25) 10.78,12.31 11.94,12.31 12.38,12.75 15.57,12.75 16.31,13.49 16.8,13.49 17.56,14.25 v1(17.56,14.52) ; v1(8.83,22.96) 4.87,26.92 2.74,26.92 1.52,28.13
  Top Layer w0.305: U7.1 8.51,8.13 8.76,8.38 9.8,8.38 10.82,7.36 11.68,7.36 11.98,7.65 11.98,8.47 10.66,9.78 10.66,12.2 v1(10.71,12.25)
  Bottom Layer w0.243: v1(17.56,14.52) 17.36,14.72 U1.14 ; v1(8.53,19.39) 8.53,22.65 v1(8.83,22.96) ; v1(10.71,12.25) 10.49,12.47 10.49,13.2 8.89,14.8 8.89,15.36 9.56,16.04 v1(10.36,16.04)
PA5: length 49.4
  Top Layer w0.243: 14.85,11.37 16.55,13.08 17.05,13.08 v1(18.32,14.34) ; v1(7.43,20.9) 6.52,21.82 3.77,21.82 2.86,22.73 2.86,24.26 1.52,25.59 ; v1(3.69,14.2) 4.91,14.2 5.52,14.81 v1(5.52,17.25)
  Top Layer w0.305: U7.6 16.72,2.46 17.53,3.26 17.53,7.68 17.33,7.87 17.33,10.18 16.14,11.37 14.85,11.37 14.32,10.84 v1(11.92,10.84)
  Bottom Layer w0.243: U1.15 17.75,15.22 18.32,14.65 v1(18.32,14.34) ; v1(11.92,10.84) 8.26,10.84 5.03,14.08 3.81,14.08 v1(3.69,14.2) ; v1(5.52,17.25) 5.52,18.99 v1(7.43,20.9)
PA6: length 39.2
  Top Layer w0.243: v1(18.17,15.62) 14.99,15.62 12.85,13.48 9.36,13.48 ; 9.36,13.48 7.23,15.61 v1(7.23,17.35) ; 9.36,13.48 v1(9.3,13.48) ; 1.52,23.05 2.96,21.61 2.96,20.09 3.88,19.18 5.7,19.18 v1(6.31,18.57)
  Top Layer w0.305: U7.2 6.81,3.73 6.1,4.44 6.1,8.4 7.21,9.52 7.21,9.56 v1(9.91,12.26)
  Bottom Layer w0.243: v1(9.3,13.48) 9.91,12.87 v1(9.91,12.26) ; v1(7.23,17.35) 7.23,17.65 v1(6.31,18.57) ; U1.16 18.07,15.72 v1(18.17,15.62)
PA7: length 53.2
  Top Layer w0.243: 1.52,20.51 2.82,19.21 2.82,0.96 3.3,0.49 14.21,0.49 14.6,0.88 16.38,0.88 18.03,2.53 18.03,11.17 17.71,11.48 17.71,12.75 18.93,13.97 v1(18.93,15.62)
  Bottom Layer w0.243: v1(18.93,15.62) 18.93,15.88 18.59,16.22 U1.17
PA8: length 24.3
  Top Layer w0.243: v1(18,19.54) 14.06,19.54 12.08,21.52 7.5,21.52 6.59,22.44 v1(5.98,22.44)
  Bottom Layer w0.243: v1(5.98,22.44) 5.37,21.83 3.85,21.83 2.93,20.91 2.93,19.38 1.52,17.97 ; v1(18,19.54) 19.01,19.54 19.19,19.36 19.67,19.36 20.01,19.69 20.01,20.17 19.7,20.49 U1.29
PA9(TXD): length 24.6
  Top Layer w0.305: v1(20.2,23.74) 20.83,24.38 20.83,24.38 21.04,24.59 27.39,24.59 31.88,29.08 31.88,34.54 v1(32.51,35.17)
  Bottom Layer w0.305: v1(32.51,35.17) 34.19,35.17 U3.7 ; U1.30 v1(20.2,23.74)
PA10(RXD): length 22.8
  Top Layer w0.305: v1(20.83,23.11) 20.83,23.24 21.69,24.1 27.79,24.1 32.58,28.89 32.58,33.59 v1(32.89,33.9)
  Bottom Layer w0.305: v1(32.89,33.9) 34.19,33.9 34.32,34.03 ; U1.31 20.7,22.98 v1(20.83,23.11)
PA11: length 33.7
  Top Layer w0.305: v1(16.35,24.83) 14.9,26.28 v1(14.22,26.28)
  Bottom Layer w0.243: 1.52,15.43 2.91,16.82 2.91,18.34 3.82,19.26 4.91,19.26 7.46,21.81 7.46,23.58 10.16,26.28 v1(14.22,26.28) ; v1(16.35,24.83) 17.47,24.83 18.67,26.03 20.7,26.03 22.99,23.74 22.99,23.11 22.24,22.36 21.34,22.36 21.21,22.24 21.21,21.23 U1.32
PA12: length 26.9
  Top Layer w0.243: v1(12.34,17.84) 11.33,16.84 v1(11.33,16.04) ; v1(13.24,19.33) 13.28,19.3 13.81,19.3 14.23,18.89 v1(18.5,18.89)
  Bottom Layer w0.243: v1(18.5,18.89) 18.73,18.66 20.06,18.66 21.7,20.3 U1.33 ; v1(11.33,16.04) 11.17,16.04 10.56,16.65 3.75,16.65 2.84,15.73 2.84,14.21 1.52,12.89
  Bottom Layer w0.305: v1(12.34,17.84) 12.34,18.43 v1(13.24,19.33)
PA13: length 47
  Bottom Layer w0.243: H4.12 2.92,8.93 2.92,7.11 3.56,6.47 5.08,6.47 5.46,6.09 17.4,6.09 18.92,4.57 23.5,4.57 26.67,7.74 26.67,11.55 24.51,13.71 23.61,13.71 20.7,16.62 20.7,18.5 22.2,20 U1.34
PA14: length 28.6
  Top Layer w0.243: 4.33,38.29 10.44,32.18 11.93,32.18 19.62,24.49 19.62,23.5 20.77,22.35 21.76,22.35 v1(23.78,20.33)
  Bottom Layer w0.243: v1(23.78,20.33) 24.39,19.72 U1.37
PA15: length 32.1
  Top Layer w0.243: 4.33,35.75 8.6,31.47 11.45,31.47 17.33,25.59 v1(17.36,25.59)
  Bottom Layer w0.243: U1.38 25.61,19.22 25.85,19.46 25.85,22.66 22.61,25.9 21.36,25.9 20.88,26.37 18.53,26.37 17.67,25.52 17.43,25.52 v1(17.36,25.59)
PB1: length 24.5
  Top Layer w0.243: v1(7.52,30.02) 8.58,30.02 13.86,24.74 v1(13.86,24.08)
  Bottom Layer w0.243: U1.19 16.11,17.13 15.41,17.13 15.23,16.94 14.15,16.94 13.83,17.27 13.83,18.58 14.25,19.01 14.25,19.78 12.57,21.45 12.57,22.79 v1(13.86,24.08) ; v1(7.52,30.02) 4.33,33.21
PB3: length 25.9
  Top Layer w0.243: v1(22.87,19.63) 22.87,19.76 19.18,23.45 19.18,24.38 18.54,25.01 17.02,25.01 11.36,30.67 4.33,30.67
  Bottom Layer w0.243: U1.39 23.78,18.72 v1(22.87,19.63)
PB4: length 25.8
  Top Layer w0.243: 4.33,28.13 8.69,28.13 13.32,23.5 14.65,23.5 15.4,24.25 18.42,24.25 18.66,24.01 18.66,23.49 19.93,22.21 19.93,21.75 22.56,19.12 v1(22.56,18.83)
  Bottom Layer w0.243: v1(22.56,18.83) 23.19,18.83 23.8,18.22 U1.40
PB5: length 33.8
  Top Layer w0.305: v1(21.44,26.64) 18.37,29.71 v1(15.88,29.71)
  Bottom Layer w0.243: 4.33,25.59 5.09,26.35 9.49,26.35 10.06,26.92 14.35,26.92 15.24,27.81 15.24,29.08 v1(15.88,29.71) ; U1.41 25.61,17.72 26.53,18.63 26.53,22.66 22.55,26.64 v1(21.44,26.64)
PB6(MPU6050_SCL): length 8.3
  Bottom Layer w0.305: U10.23 30.6,14.18 30.21,14.18 30.14,14.1 R27.1 28.09,14.9 28.09,16.61 27.79,16.91 26.64,16.91 26.34,17.22 U1.42
PB7(MPU6050_SDA): length 8.4
  Top Layer w0.305: v1(26.46,16.3) 26.8,16.63 v1(29.08,16.63)
  Bottom Layer w0.305: v1(26.46,16.3) 26.26,16.3 25.9,16.66 25.47,16.66 25.41,16.72 U1.43 ; 29.08,15.74 28.89,15.55 ; 29.08,15.74 29.34,16 29.34,16.38 v1(29.08,16.63) ; 29.08,15.74 29.08,15.17 29.52,14.74 U10.24
PB8: length 23.4
  Top Layer w0.243: v1(22.56,16.94) 22.05,16.94 20.33,18.66 19.74,18.66 17.83,20.57 13.59,20.57 12.04,22.12 8.85,22.12 7.91,23.05 4.33,23.05
  Bottom Layer w0.243: U1.45 23.78,15.72 v1(22.56,16.94)
PB9: length 22.8
  Top Layer w0.243: 4.33,20.51 4.75,20.09 9.7,20.09 v1(11.61,18.19) ; v1(22.56,15.83) 22.39,16 21.34,16 20.7,16.63 13.06,16.63 v1(12.9,16.79)
  Bottom Layer w0.243: U1.46 23.17,15.22 v1(22.56,15.83) ; v1(12.9,16.79) 12.57,16.79 11.61,17.75 v1(11.61,18.19)
PB15: length 28.8
  Top Layer w0.243: 4.33,17.97 7.51,17.97 10.05,15.43 11.86,15.43 12.63,16.2 20.65,16.2 21.72,15.12 22.85,15.12 23.24,15.51 23.24,17.08 20.39,19.93 v1(19.43,19.93)
  Bottom Layer w0.305: v1(19.43,19.93) 19.2,20.17 U1.28
PC13: length 24.7
  Top Layer w0.243: v1(18.54,11.51) 18.67,11.64 18.67,12 18.29,12.38 18.29,12.84 19.51,14.06 v1(19.51,14.2)
  Bottom Layer w0.243: 4.33,15.43 8.29,11.47 14.52,11.47 14.81,11.75 16.76,11.75 17,11.51 18.54,11.51 v1(18.54,11.51) ; U1.2 22.7,13.94 21.62,15.02 21.05,15.02 20.47,14.44 19.74,14.44 v1(19.51,14.2)
PC14: length 24.8
  Top Layer w0.243: v1(18.61,10.75) 19.14,11.28 19.14,13.02 20.09,13.97 20.09,14.24 20.7,14.85 20.93,14.85 21.41,14.37 21.44,14.37 v1(21.8,14.02) ; v1(13.99,13.44) 13.3,13.44 12.99,13.14 9.81,13.14 9.37,12.69 6.02,12.69 v1(5.74,12.41) ; v1(16.96,12.36) 16.96,11.41 v1(17.45,10.93)
  Bottom Layer w0.243: v1(13.99,13.44) 14.35,13.09 14.35,13.08 15.33,12.1 16.7,12.1 v1(16.96,12.36) ; v1(5.74,12.41) 4.81,12.41 4.33,12.89 ; U1.3 22.2,13.63 21.81,14.02 v1(21.8,14.02) ; v1(18.61,10.75) 18.48,10.62 18.2,10.62 17.89,10.93 v1(17.45,10.93)
PC15: length 34.7
  Bottom Layer w0.243: 26.29,11.41 26.29,8.12 23.24,5.08 19.18,5.08 17.65,6.6 8.08,6.6 4.33,10.35
  Bottom Layer w0.305: 26.28,11.41 25.43,12.26 25.07,12.26 24.76,11.96 23.67,11.96 23.38,11.66 22.01,11.66 21.76,11.92 21.76,12.66 U1.4
RES: length 9
  Bottom Layer w0.305: 21.13,33.47 21.3,33.3 21.3,29.73 C50.2 22.21,29.42 23.21,30.41 D2.2 24.53,30.41 R33.1
SCL_OLED: length 24.5
  Top Layer w0.203: v1(11.56,20.82) 11.56,19.58 13.49,17.65 v1(14.86,17.65)
  Bottom Layer w0.203: 18.33,33.47 18.33,29.5 R31.2 17.6,28.57 16.32,28.57 16.12,28.37 16.12,26.15 15.03,25.06 12.81,25.06 11.56,23.8 v1(11.56,20.82) ; U1.21 16.14,18.16 15.4,18.16 14.89,17.65 v1(14.86,17.65)
SDA_OLED: length 24.9
  Top Layer w0.203: v1(14.4,18.31) 13.41,18.31 12.63,19.08 12.63,19.87 v1(12.32,20.19)
  Bottom Layer w0.203: v1(14.4,18.31) 14.75,18.66 16.14,18.66 U1.22 ; v1(12.32,20.19) 11.18,20.19 10.83,20.53 10.83,23.62 12.61,25.39 14.86,25.39 15.75,26.28 15.75,28.53 16.62,29.4 R32.1 17.27,29.77 17.27,33.15 16.94,33.47
  Bottom Layer w0.305: 17.63,33.47 16.93,33.47
UD+: length 52.1
  Top Layer w0.305: 25.53,8.79 24.97,8.79 24.79,8.61 24.79,7.88 USB2.A6 ; 25.53,8.79 25.7,8.61 25.7,7.88 USB2.B6 ; 25.53,8.79 26.1,9.36 26.1,10.59 34.94,19.43 42.93,19.43 43.94,20.44 43.94,22.6 42.67,23.87 39.88,23.87 39.22,24.53 39.22,25.17 36.91,27.48 36.91,29.62 36.63,29.9 36.63,30.99 36.91,31.27 36.91,32.86 36.63,33.14 36.63,34.24 36.91,34.52 36.91,36.53 38.09,37.71 v1(39.5,37.71)
  Bottom Layer w0.305: v1(39.5,37.71) 39.85,37.36 U3.1
UD-: length 52.1
  Top Layer w0.305: USB2.A7 25.21,7.79 25.21,7.06 25.03,6.88 24.47,6.88 24.3,7.06 24.3,7.79 USB2.B7 24.3,7.88 24.3,8.69 25.14,9.53 25.14,10.56 34.8,20.21 36.98,20.21 37.53,20.77 37.53,24.84 37.23,25.14 36.12,25.14 35.81,25.45 35.81,28.04 36.14,28.36 36.14,29.45 35.92,29.67 35.38,29.67 35.17,29.88 35.17,30.98 35.38,31.19 36.19,31.19 36.41,31.41 36.41,32.5 36.19,32.72 35.38,32.72 35.17,32.93 35.17,34.02 35.38,34.24 35.6,34.24 35.81,34.45 35.81,36.02 38.27,38.48 39.88,38.48 v1(40.39,37.97)
  Bottom Layer w0.305: U3.2 40.77,35.3 41.17,35.71 41.17,36.82 40.39,37.6 v1(40.39,37.97)
$1N2097: length 2.1
  Top Layer w0.305: LED1.2 47.85,4.61 R15.1
$1N2713: length 4.6
  Bottom Layer w0.305: R30.2 13.98,30.76 12.9,31.85 12.9,33.3 12.73,33.47
$1N2714: length 4.3
  Bottom Layer w0.305: 12.03,33.47 12.2,33.3 12.2,31.85 12.36,31.69 C49.2
$1N2715: length 4.5
  Bottom Layer w0.305: 11.33,33.47 11.43,33.37 11.43,31.99 10.68,31.24 C48.2
$1N2716: length 4.3
  Bottom Layer w0.305: 28.83,33.47 29,33.3 29,29.57 C46.1
$1N2717: length 6
  Bottom Layer w0.305: 29.53,33.47 29.53,30.32 29.98,29.87 29.98,28.82 29.53,28.37 29.53,28.25 C46.2
$1N2718: length 6.2
  Bottom Layer w0.305: C47.1 27.32,28.18 26.85,28.65 26.74,28.65 26.56,28.83 26.56,29.88 27.43,30.75 27.43,33.47
$1N2719: length 4.5
  Bottom Layer w0.305: C47.2 28.13,30.17 28.13,33.47
$1N4956: length 1.6
  Top Layer w0.305: Q2.1 36.27,22.97 R16.2
$1N5026: length 2.8
  Top Layer w0.305: Q2.3 38.47,22.22 41.23,22.22
$1N6067: length 3.8
  Bottom Layer w0.305: U3.8 34.32,37.99 34.83,38.5 C38.1
$1N6367: length 3.8
  Top Layer w0.305: U7.7 U7.8 16.31,6.5 C41.2
$1N6697: length 2.4
  Bottom Layer w0.305: C43.2 35.65,12.73 35.15,13.24 U10.10
$1N6965: length 1.9
  Bottom Layer w0.305: U10.20 30.6,12.68 30.21,12.68 30.06,12.53 28.84,12.53
$1N8605: length 17
  Top Layer w0.305: v1(21.29,16.88) 20.02,18.16 v1(17.53,18.16) ; v1(29.97,18.03) 29.97,18.54 29.84,18.66 24.26,18.66 v1(23.37,17.78)
  Bottom Layer w0.305: v1(21.29,16.88) 21.59,16.88 22.48,17.78 v1(23.37,17.78) ; R29.2 29.72,17.78 v1(29.97,18.03) ; v1(17.53,18.16) 17.09,17.72 U1.20
$1N9414: length 2.2
  Top Layer w0.305: R22.2 23.75,10.02 USB2.A5
$1N9519: length 2.2
  Top Layer w0.305: R23.1 26.81,8.62 26.79,8.61 26.79,7.88 USB2.B5

## Copper pours and planes (outline as drawn; the poured copper is in the pictures)
3V3 on Top Layer: -5.97,44.44 56.77,44.44 56.77,-2.93 -5.97,-2.93
3V3 on Inner1: 0.26,39.74 49.74,39.74 49.74,0.26 0.26,0.26
GND on Top Layer: -3.56,42.79 54.86,42.79 54.86,-3.05 -3.56,-3.05
GND on Bottom Layer: -9.14,44.7 58.17,44.7 58.17,-3.05 -9.14,-3.05
GND on Inner2: 0.26,39.74 49.74,39.74 49.74,0.26 0.26,0.26

Small or netless copper shapes (teardrops, artwork), in the pictures only: 1 on Top Layer, 3 on Inner1, 24 on Inner2

## Text on the board
Bottom Silkscreen Layer: PA0 | PA2 | PA3 | PA4 | PA6 | PA8 | PA11 | PA12 | PA13 | 3.3V | GND | PA5 | PB5 | PA14 | PA15 | PB1 | PB3 | PB4 | PB9 | PB15 | PC13 | PC14 | PC15 | 5V | PB8 | PA7 | PA1
